# Altium schematic sheet USB.SchDoc
size A4
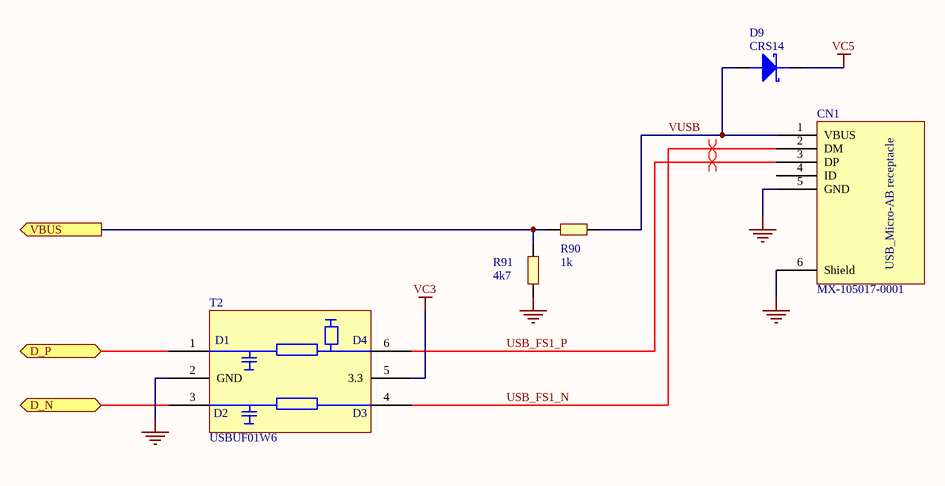
[diagram p0: USB.SchDoc]

## Parts
CN1  MX-105017-0001  [MOLEX_MICROUSB_MX-105017-0001]
D9  CRS14  [1206D]
R90  1k  [0805R]
R91  4k7  [0805R]
T2  USBUF01W6  [SOTT323-6L]

## Ports
D_N (bidir), D_P (bidir), VBUS (out)

## Nets
GND: CN1.5(GND) CN1.6(Shield) R91.2 T2.2(GND)
VC3: T2.5(3.3)
VC5: D9.K
D_N: T2.3(D2) ; port D_N
D_P: T2.1(D1) ; port D_P
USB_FS1_N: CN1.2(DM) T2.4(D3)
USB_FS1_P: CN1.3(DP) T2.6(D4)
VBUS: R90.2 R91.1 ; port VBUS
VUSB: CN1.1(VBUS) D9.A R90.1

Not connected (* = marked no-connect by the designer): CN1 4(ID)

## Layout directives
differential pair: USB_FS1_N, USB_FS1_P

## Notes on the sheet
- (in symbol USB-MICRO-AB) USB_Micro-AB receptacle

## Library data of the parts
CN1 = USB-MICRO-AB: Manuf_1: MOLEX; Manuf_Part_1: 47590-0001; Description: USB-MICRO-AB, 47590-0001, SMT, MOLEX; Ref St: xxxxxxx; ECCN_US/EU: n/a; Distrib: *
D9 = DIODE SCHOTTKY: Schottky Diode; Dostawca: TME; Dostawca.Symbol: CRS14
R90 R91 = RES3